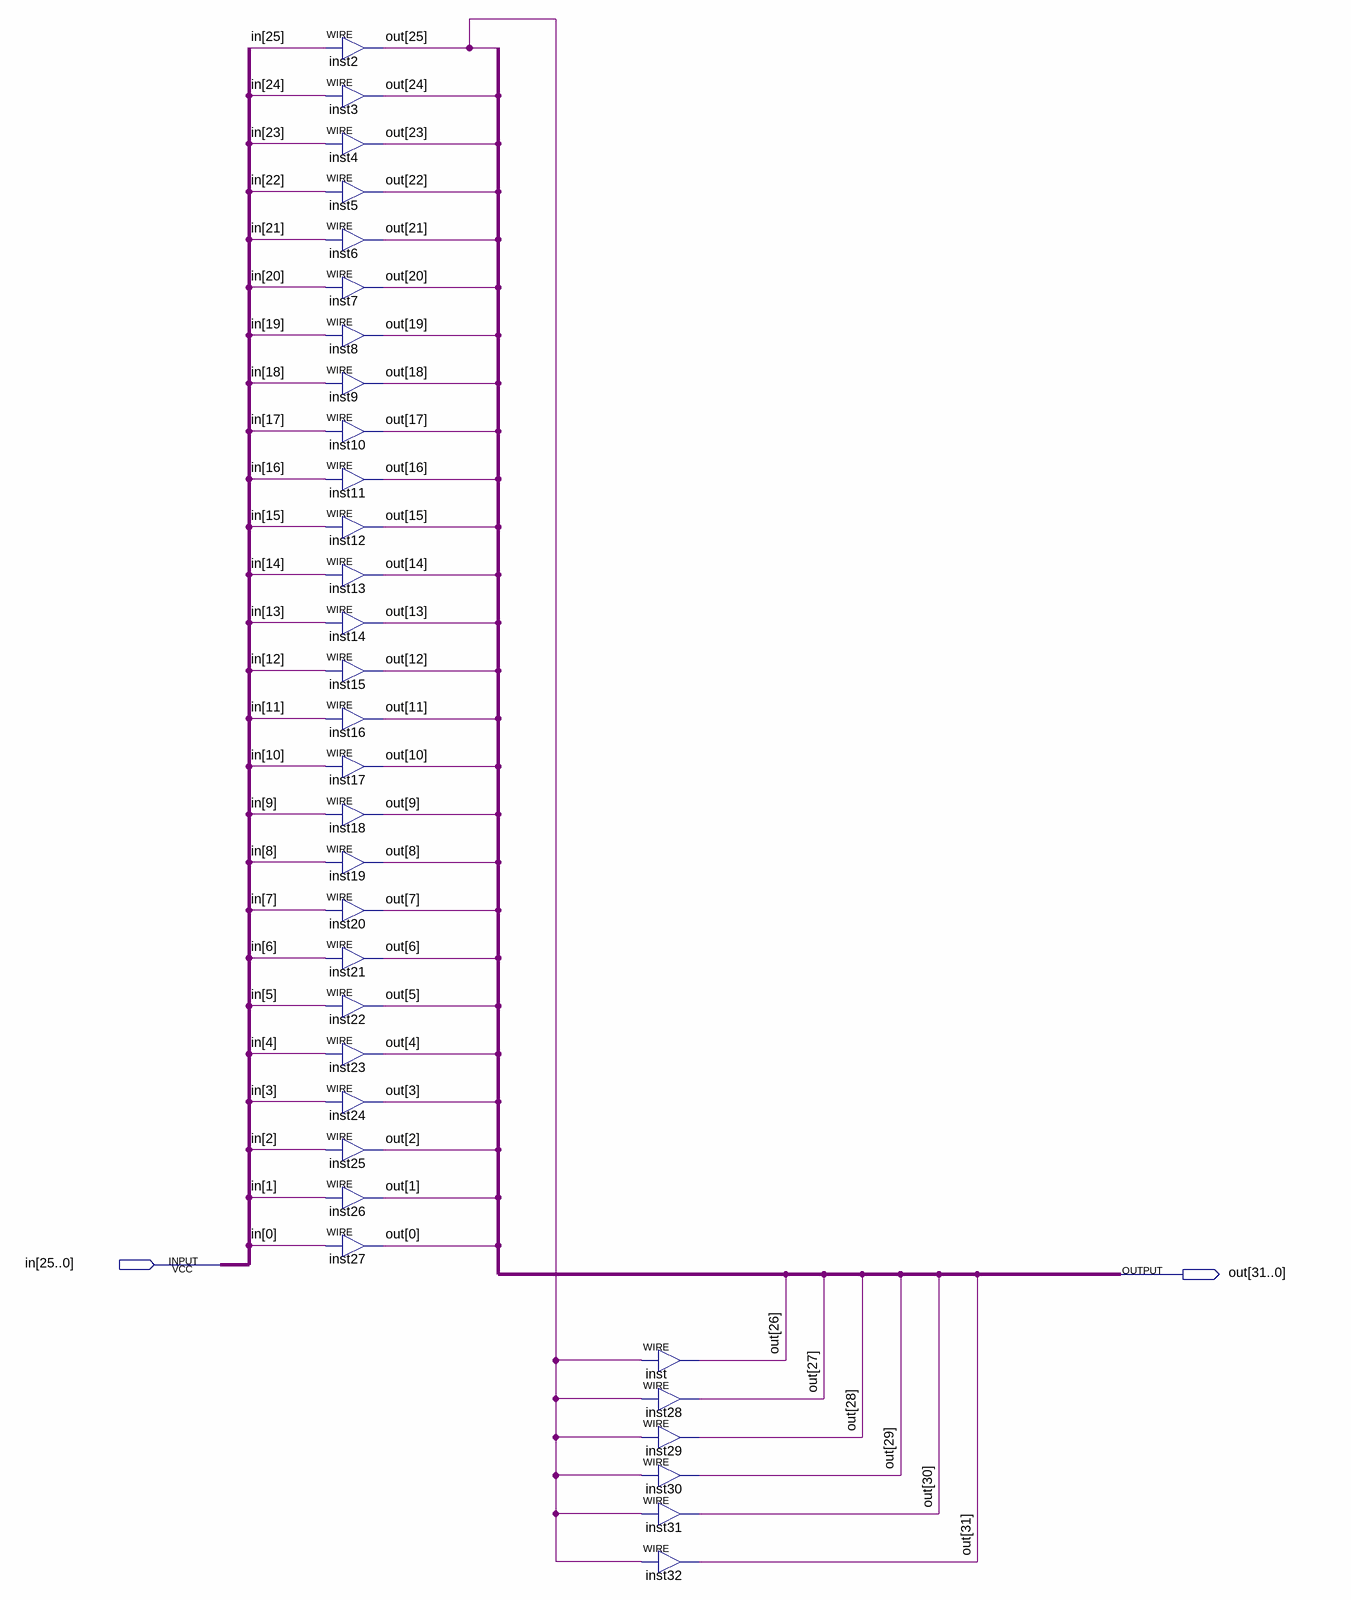
[diagram p0: schematic sheet]
// Quartus schematic extensor6bits.bdf as structural Verilog: 32 symbols, 2 pins
module extensor6bits (
  input  [25:0] in,
  output [31:0] out
);

  assign out[25] = in[25];  // WIRE inst2
  assign out[24] = in[24];  // WIRE inst3
  assign out[23] = in[23];  // WIRE inst4
  assign out[22] = in[22];  // WIRE inst5
  assign out[21] = in[21];  // WIRE inst6
  assign out[20] = in[20];  // WIRE inst7
  assign out[19] = in[19];  // WIRE inst8
  assign out[18] = in[18];  // WIRE inst9
  assign out[17] = in[17];  // WIRE inst10
  assign out[16] = in[16];  // WIRE inst11
  assign out[15] = in[15];  // WIRE inst12
  assign out[14] = in[14];  // WIRE inst13
  assign out[13] = in[13];  // WIRE inst14
  assign out[12] = in[12];  // WIRE inst15
  assign out[11] = in[11];  // WIRE inst16
  assign out[10] = in[10];  // WIRE inst17
  assign out[9] = in[9];  // WIRE inst18
  assign out[8] = in[8];  // WIRE inst19
  assign out[7] = in[7];  // WIRE inst20
  assign out[6] = in[6];  // WIRE inst21
  assign out[5] = in[5];  // WIRE inst22
  assign out[4] = in[4];  // WIRE inst23
  assign out[3] = in[3];  // WIRE inst24
  assign out[2] = in[2];  // WIRE inst25
  assign out[1] = in[1];  // WIRE inst26
  assign out[0] = in[0];  // WIRE inst27
  assign out[26] = out[25];  // WIRE inst
  assign out[27] = out[25];  // WIRE inst28
  assign out[28] = out[25];  // WIRE inst29
  assign out[29] = out[25];  // WIRE inst30
  assign out[30] = out[25];  // WIRE inst31
  assign out[31] = out[25];  // WIRE inst32
endmodule
